# Altium schematic sheet USB.SchDoc: =project_title
size Tabloid; PageSetup: Record=PageOptions|CenterHorizontal=True|CenterVertical=True|PrintScale=0.73|XCorrection=1.00|YCorrection=1.00|PrintKind=0|BorderSize=5000000|LeftOffset=0|BottomOffset=0|Orientation=2|PaperLength=1000|PaperWidth=1000|Scale=100|PaperSource=7|PrintQuality=-4|MediaType=1|DitherType=10|PaperKind=A4|PrintScaleMode=1; CompanyName: Luxonis Holding; Organization: Luxonis Holding; Address1: 1925 Harmony Park Drive; Address2: Westminster, CO; Address3: 80234; Address4: United States; SheetNumber: 11; SheetTotal: 12
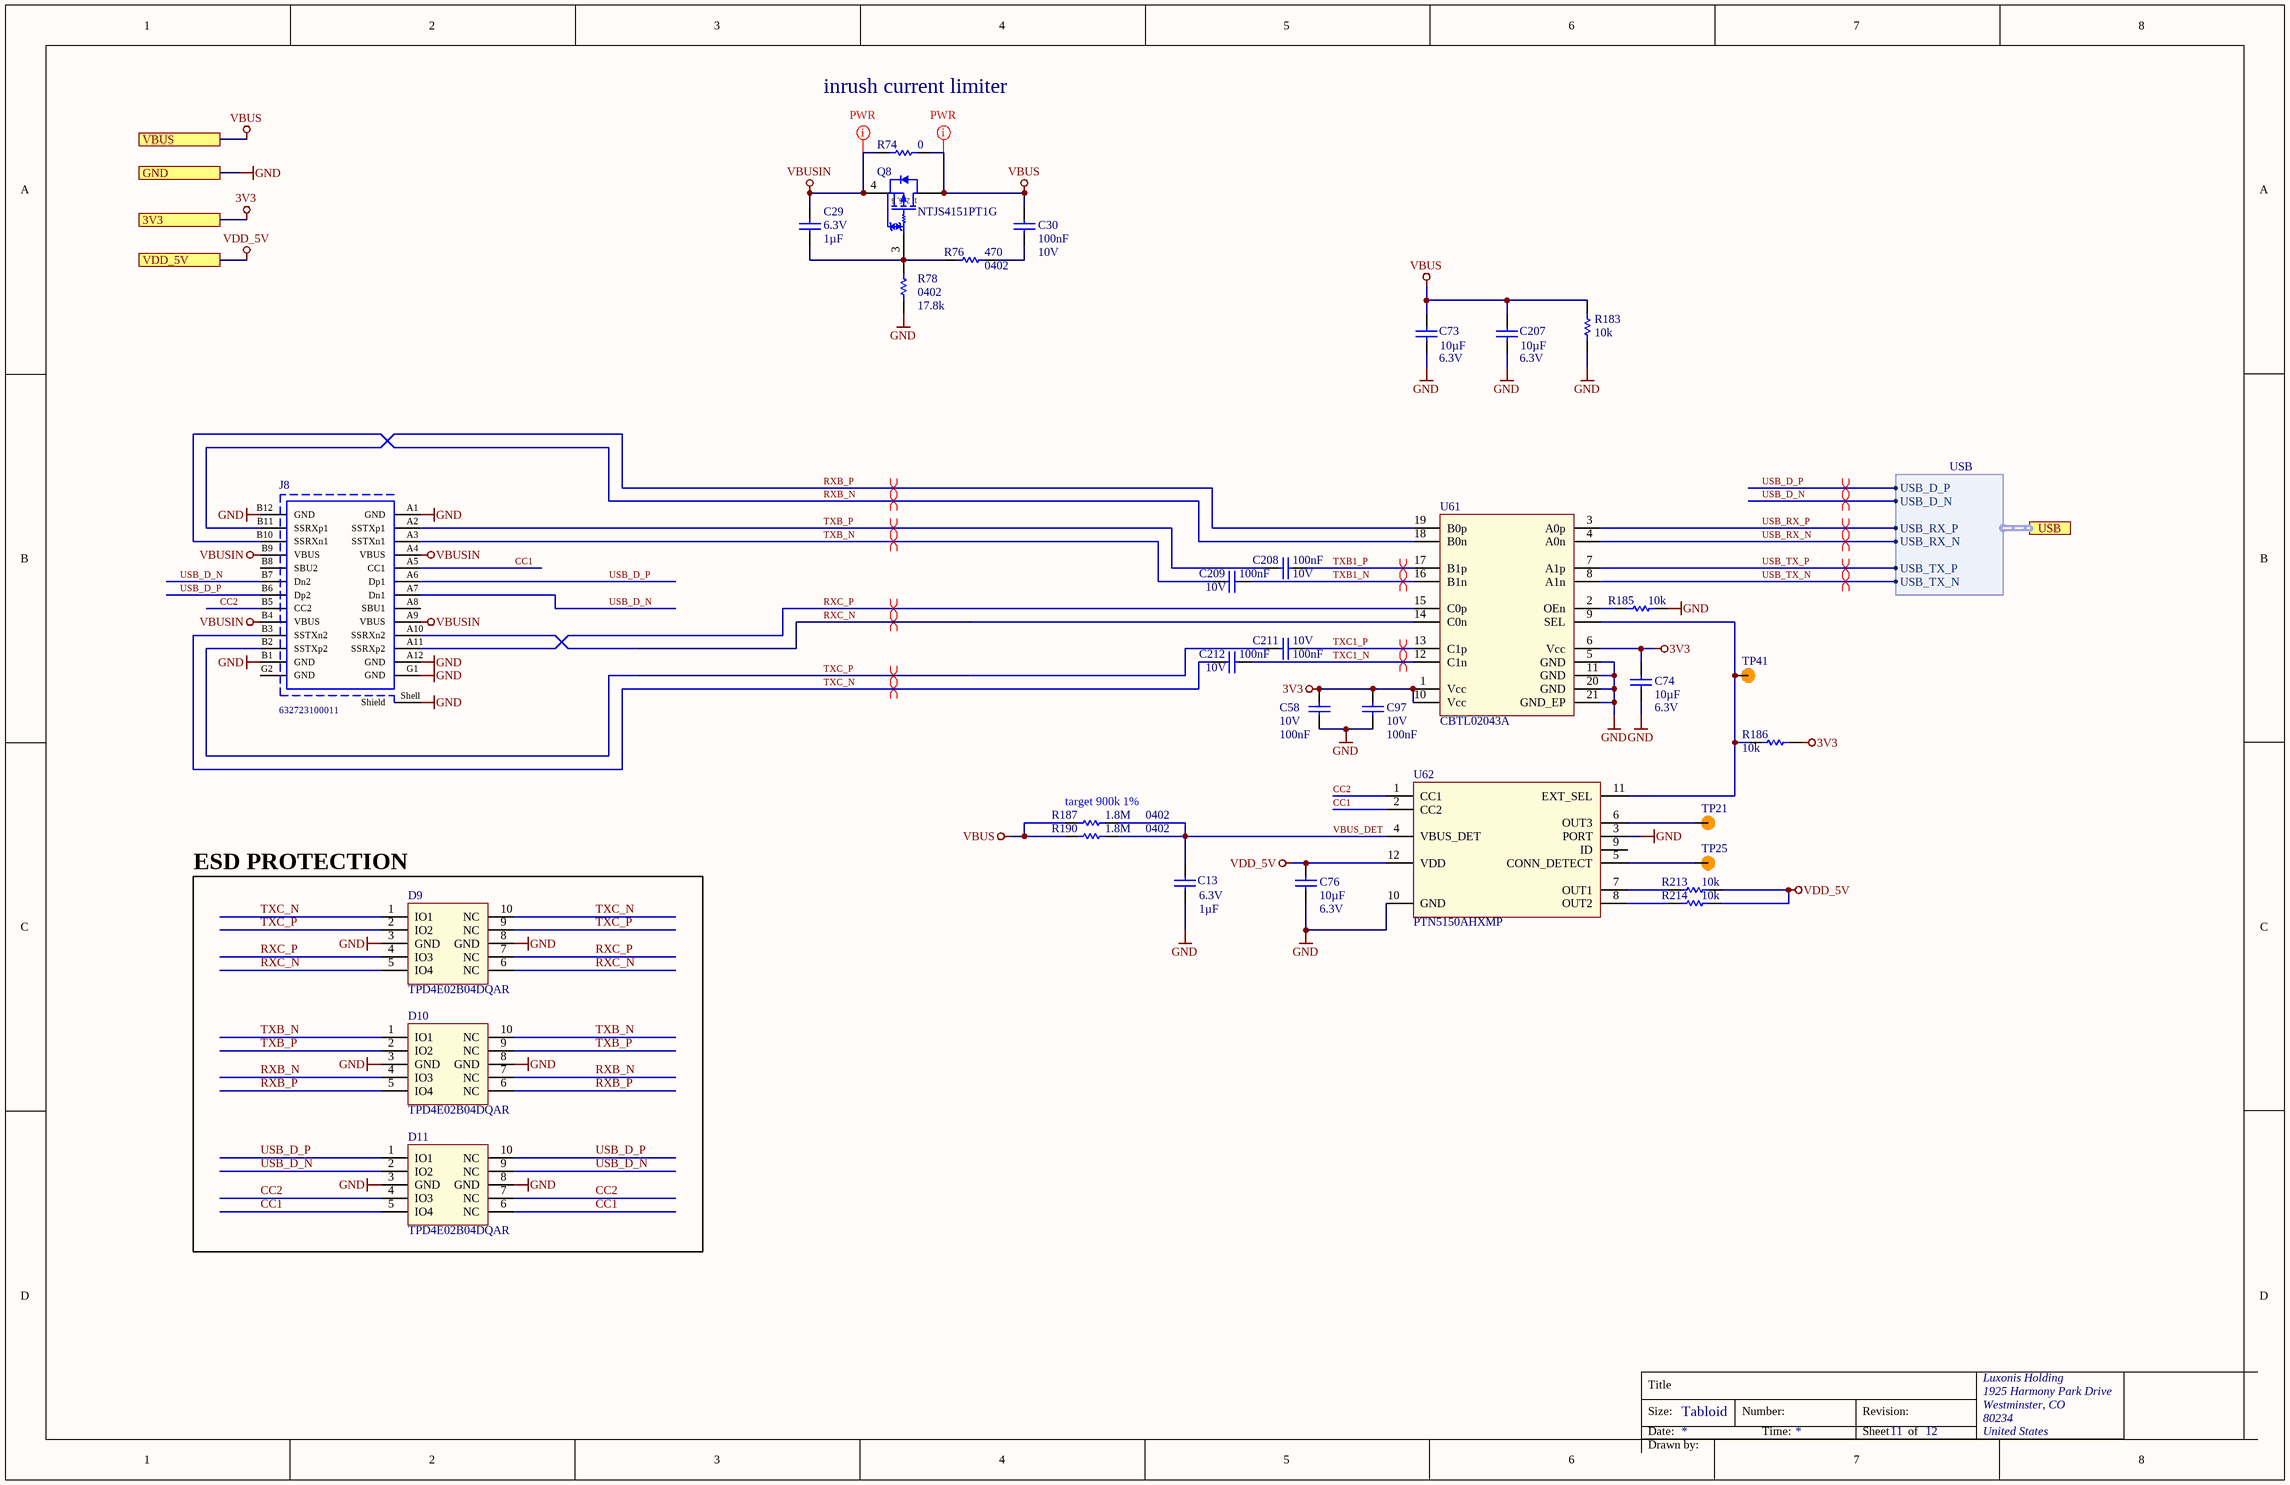
[diagram p0: USB.SchDoc]

## Parts
C13  value 1µF  Voltage Rating: 6.3V  [CAPC0201(0603)33_L]  (hidden comment: GRM033R60J105MEA2D)
C29  value 1µF  Voltage Rating: 6.3V  [CAPC0201(0603)33_L]  (hidden comment: GRM033R60J105MEA2D)
C30  value 100nF  Voltage Rating: 10V  [CAPC0201(0603)33_L]  (hidden comment: GRM033R61A104KE15D)
C58  value 100nF  Voltage Rating: 10V  [CAPC0201(0603)33_L]  (hidden comment: GRM033R61A104KE15D)
C73  value 10µF  Voltage Rating: 6.3V  [CAPC0402(1005)70_N]  (hidden comment: GRM155R60J106ME15D)
C74  value 10µF  Voltage Rating: 6.3V  [CAPC0402(1005)70_N]  (hidden comment: GRM155R60J106ME15D)
C76  value 10µF  Voltage Rating: 6.3V  [CAPC0402(1005)70_N]  (hidden comment: GRM155R60J106ME15D)
C97  value 100nF  Voltage Rating: 10V  [CAPC0201(0603)33_L]  (hidden comment: GRM033R61A104KE15D)
C207  value 10µF  Voltage Rating: 6.3V  [CAPC0402(1005)70_N]  (hidden comment: GRM155R60J106ME15D)
C208  value 100nF  Voltage Rating: 10V  [CAPC0201(0603)33_L]  (hidden comment: GRM033R61A104KE15D)
C209  value 100nF  Voltage Rating: 10V  [CAPC0201(0603)33_L]  (hidden comment: GRM033R61A104KE15D)
C211  value 100nF  Voltage Rating: 10V  [CAPC0201(0603)33_L]  (hidden comment: GRM033R61A104KE15D)
C212  value 100nF  Voltage Rating: 10V  [CAPC0201(0603)33_L]  (hidden comment: GRM033R61A104KE15D)
D9  TPD4E02B04DQAR  [TPD4E02B04DQAR]
D10  TPD4E02B04DQAR  [TPD4E02B04DQAR]
D11  TPD4E02B04DQAR  [TPD4E02B04DQAR]
J8  632723100011  [632723100011]
Q8  NTJS4151PT1G  [ONSC-SC70-6-419B-02_W_V]
R74  value 0  [RESC0603(1608)_L]  (hidden comment: CRCW06030000Z0EA)
R76  value 470  Case/Package: 0402  [RESC0402(1005)_L]  (hidden comment: CRCW0402470RFKED)
R78  value 17.8k  Case/Package: 0402  [RESC0402(1005)_L]  (hidden comment: ERJ-2RKF1782X)
R183  value 10k  [RESC0402(1005)_N]  (hidden comment: RC0402FR-1310KL)
R185  value 10k  [RESC0402(1005)_N]  (hidden comment: RC0402FR-1310KL)
R186  value 10k  [RESC0402(1005)_N]  (hidden comment: RC0402FR-1310KL)
R187  value 1.8M  Case/Package: 0402  [RESC0402(1005)_N]  (hidden comment: CRCW04021M80FKED)
R190  value 1.8M  Case/Package: 0402  [RESC0402(1005)_N]  (hidden comment: CRCW04021M80FKED)
R213  value 10k  [RESC0402(1005)_N]  (hidden comment: RC0402FR-1310KL)
R214  value 10k  [RESC0402(1005)_N]  (hidden comment: RC0402FR-1310KL)
TP21  TEST_POINT  [TP075_150_NS]  (value not drawn)  (no BOM)
TP25  TEST_POINT  [TP075_150_NS]  (value not drawn)  (no BOM)
TP41  TEST_POINT  [TP075_150_NS]  (value not drawn)  (no BOM)
U61  CBTL02043A  [CBTL02043A]
U62  PTN5150AHXMP  [PTN5150H]

## Blocks framed on the sheet
ESD PROTECTION: D9-D11

## Ports
3V3, GND, USB (harness USB), VBUS, VDD_5V

## Harnesses
USB: USB_D_P, USB_D_N, USB_TX_N, USB_TX_P, USB_RX_N, USB_RX_P

## Nets
3V3: C58.2 C74.2 C97.2 R186.2 U61.1(Vcc) U61.6(Vcc) U61.10(Vcc) ; port 3V3
GND: C13.1 C58.1 C73.1 C74.1 C76.1 C97.1 C207.1 D9.3(GND) D9.8(GND) D10.3(GND) D10.8(GND) D11.3(GND) D11.8(GND) J8.A1(GND) J8.A12(GND) J8.B1(GND) J8.B12(GND) J8.G1(GND) J8.Shell(Shield) R78.1 R183.1 R185.2 U61.5(GND) U61.11(GND) U61.20(GND) U61.21(GND_EP) U62.3(PORT) U62.10(GND) ; port GND
VBUS: C30.2 C73.2 C207.2 Q8.1(D) Q8.2(D) Q8.5(D) Q8.6(D) R74.2 R183.2 R187.1 R190.1 ; port VBUS
VBUSIN: C29.2 J8.A4(VBUS) J8.A9(VBUS) J8.B4(VBUS) J8.B9(VBUS) Q8.4(S) R74.1
VDD_5V: C76.2 R213.2 R214.2 U62.12(VDD) ; port VDD_5V
CC1: D11.5(IO4) D11.6(NC) J8.A5(CC1) U62.2(CC2)
CC2: D11.4(IO3) D11.7(NC) J8.B5(CC2) U62.1(CC1)
RXB_N: D10.4(IO3) D10.7(NC) J8.B10(SSRXn1) U61.18(B0n)
RXB_P: D10.5(IO4) D10.6(NC) J8.B11(SSRXp1) U61.19(B0p)
RXC_N: D9.5(IO4) D9.6(NC) J8.A10(SSRXn2) U61.14(C0n)
RXC_P: D9.4(IO3) D9.7(NC) J8.A11(SSRXp2) U61.15(C0p)
TXB1_N: C209.2 U61.16(B1n)
TXB1_P: C208.2 U61.17(B1p)
TXB_N: C209.1 D10.1(IO1) D10.10(NC) J8.A3(SSTXn1)
TXB_P: C208.1 D10.2(IO2) D10.9(NC) J8.A2(SSTXp1)
TXC1_N: C212.2 U61.12(C1n)
TXC1_P: C211.2 U61.13(C1p)
TXC_N: C212.1 D9.1(IO1) D9.10(NC) J8.B3(SSTXn2)
TXC_P: C211.1 D9.2(IO2) D9.9(NC) J8.B2(SSTXp2)
USB_D_N: D11.2(IO2) D11.9(NC) J8.A7(Dn1) J8.B7(Dn2) ; port USB.USB_D_N
USB_D_P: D11.1(IO1) D11.10(NC) J8.A6(Dp1) J8.B6(Dp2) ; port USB.USB_D_P
USB_RX_N: U61.4(A0n) ; port USB.USB_RX_N
USB_RX_P: U61.3(A0p) ; port USB.USB_RX_P
USB_TX_N: U61.8(A1n) ; port USB.USB_TX_N
USB_TX_P: U61.7(A1p) ; port USB.USB_TX_P
VBUS_DET: C13.2 R187.2 R190.2 U62.4(VBUS_DET)
NetC29_1: C29.1 Q8.3(G) R76.1 R78.2
NetC30_1: C30.1 R76.2
NetR185_1: R185.1 U61.2(OEn)
NetR186_1: R186.1 TP41.1 U61.9(SEL) U62.11(EXT_SEL)
NetR213_1: R213.1 U62.7(OUT1)
NetR214_1: R214.1 U62.8(OUT2)
NetTP21_1: TP21.1 U62.6(OUT3)
NetTP25_1: TP25.1 U62.5(CONN_DETECT)

Not connected (* = marked no-connect by the designer): J8 A8(SBU1) B8(SBU2) G2(GND); U62 9(ID)

## Layout directives
differential pair; differential pair class USB3: RXB_N, RXB_P, RXC_N, RXC_P, TXB1_N, TXB1_P, TXB_N, TXB_P, TXC1_N, TXC1_P, TXC_N, TXC_P, USB_D_N, USB_D_P, USB_RX_N, USB_RX_P, USB_TX_N, USB_TX_P
net class Power_trace: VBUS, VBUSIN

## Notes on the sheet
- inrush current limiter
- (near R187) target 900k 1%
- Title
- Size:
- Date:
- Tabloid
- Number:
- Time:
- Revision:
- Sheet
- of
- Drawn by:
- (in symbol CMP-061-000004-2) 1, 2, 5, 6

## Library data of the parts
C13 C29 = CMP-004-000006-5: CAP CER 1UF 6.3V X5R 0201 20%; Manufacturer 1: Murata; Manufacturer Part Number 1: GRM033R60J105MEA2D; Case/Package: 0201; Min Operating Temperature: -55°C; Max Operating Temperature: 85°C; Tolerance: 20%; Dielectric: X5R; Length: 0.6mm; Height: 0.3mm; Width: 0.3mm; Depth: 0.3mm; ComponentLink1URL: https://datasheet.ciiva.com/18699/grm033r60j105mea2-02-18699520.pdf?src-supplier=Digi-Key; ComponentLink1Description: https://datasheet.ciiva.com/18699/grm033r60j105mea2-02-18699520.pdf?src-supplier=Digi-Key; ComponentLink2URL: https://datasheet.ciiva.com/24218/c02e-24218376.pdf?src-supplier=Mouser; ComponentLink2Description: https://datasheet.ciiva.com/24218/c02e-24218376.pdf?src-supplier=Mouser; ComponentLink3URL: https://datasheet.ciiva.com/18699/partnumbering-e-01-18699519.pdf?src-supplier=Digi-Key; ComponentLink3Description: https://datasheet.ciiva.com/18699/partnumbering-e-01-18699519.pdf?src-supplier=Digi-Key; Design Item ID: GRM033R60J105MEA2D; Mounting Technology: SMT
C30 C58 C97 C208 C209 C211 C212 = CMP-004-000007-6: CAP CER 0.1UF 10V X5R 0201 10%; Manufacturer 1: Murata; Manufacturer Part Number 1: GRM033R61A104KE15D; Case/Package: 0201; Min Operating Temperature: -55°C; Max Operating Temperature: 85°C; Tolerance: 10%; Dielectric: X5R; Length: 0.6mm; Height: 0.3mm; Width: 0.012inch; Depth: 0.3mm; ComponentLink1URL: https://datasheet.ciiva.com/26843/getdatasheetpartid-308656-26843739.pdf?src-supplier=Verical; ComponentLink1Description: https://datasheet.ciiva.com/26843/getdatasheetpartid-308656-26843739.pdf?src-supplier=Verical; ComponentLink2URL: https://datasheet.ciiva.com/5413/product-5413117.pdf?src-supplier=Mouser; ComponentLink2Description: https://datasheet.ciiva.com/5413/product-5413117.pdf?src-supplier=Mouser; ComponentLink3URL: https://datasheet.ciiva.com/6256/partnumbering-e-01-6256406.pdf?src-supplier=Digi-Key; ComponentLink3Description: https://datasheet.ciiva.com/6256/partnumbering-e-01-6256406.pdf?src-supplier=Digi-Key; ComponentLink4URL: https://datasheet.ciiva.com/6256/partnumbering-e-01-6256407.pdf?src-supplier=Digi-Key; ComponentLink4Description: https://datasheet.ciiva.com/6256/partnumbering-e-01-6256407.pdf?src-supplier=Digi-Key; ComponentLink5URL: https://datasheet.ciiva.com/6256/partnumbering-e-01-6256408.pdf?src-supplier=Digi-Key; ComponentLink5Description: https://datasheet.ciiva.com/6256/partnumbering-e-01-6256408.pdf?src-supplier=Digi-Key; Design Item ID: GRM033R61A104KE15D; Mounting Technology: SMT
C73 C74 C76 C207 = CMP-004-000009-5: CAP CER 10UF 6.3V X5R 0402 20%; Manufacturer 1: Murata; Manufacturer Part Number 1: GRM155R60J106ME15D; Case/Package: 0402; Min Operating Temperature: -55°C; Max Operating Temperature: 85°C; Dielectric: X5R; Length: 0.039inch; Width: 0.02inch; ComponentLink1URL: https://www.murata.com/~/media/webrenewal/support/library/catalog/products/capacitor/mlcc/c02e.ashx?la=en-us&src-supplier=Digi-Key; ComponentLink1Description: https://www.murata.com/~/media/webrenewal/support/library/catalog/products/capacitor/mlcc/c02e.ashx?la=en-us&src-supplier=Digi-Key; Tolerance: 20%; Design Item ID: GRM155R60J106ME15D; Mounting Technology: SMT
D9-D11 = CMP-111-000006-2: TVS DIODE 3.6V 8.8V 10USON 8.8V (Typ) Clamp 5A (8/20µs) Ipp Tvs Diode Surface Mount 10-USON (2.5x1); Manufacturer 1: Texas Instruments; Number of Bidirectional Channels: 4; Min Breakdown Voltage: 5.5V; Peak Pulse Power: 17W; Power Line Protection: No; Interface: USB,HDMI; Manufacturer Part Number 1: TPD4E02B04DQAR; Stock 1: 25615; Pricing 1: 1=0.69000, 10=0.60800, 100=0.46650, 500=0.36874, 1000=0.29499 (USD); RoHS: Yes; Mount: Surface Mount; Number of Pins: 10; Min Operating Temperature: -40°C; Max Operating Temperature: 125°C; Packaging: Cut Tape; Reverse Standoff Voltage: 3.6V; Clamping Voltage: 8.8V; Operating Supply Voltage: 3.6V; Peak Pulse Current: 5A; Number of Channels: 4; Composition: Zener; REACH SVHC: No SVHC; Lead Free: Lead Free; ComponentLink1URL: http://www.ti.com/general/docs/lit/getliterature.tsp?genericPartNumber=TPD4E02B04&amp;&amp;fileType=pdf&src-supplier=Element14; ComponentLink1Description: http://www.ti.com/general/docs/lit/getliterature.tsp?genericPartNumber=TPD4E02B04&amp;&amp;fileType=pdf&src-supplier=Element14; ComponentLink2URL: http://www.ti.com/lit/ds/symlink/tpd4e02b04.pdf?src-supplier=Farnell; ComponentLink2Description: http://www.ti.com/lit/ds/symlink/tpd4e02b04.pdf?src-supplier=Farnell; ComponentLink3URL: http://www.ti.com/lit/ds/symlink/tpd4e02b04.pdf?src-supplier=Newark; ComponentLink3Description: http://www.ti.com/lit/ds/symlink/tpd4e02b04.pdf?src-supplier=Newark; ComponentLink4URL: http://www.ti.com/lit/ds/symlink/tpd4e02b04.pdf?src-supplier=Digi-Key; ComponentLink4Description: http://www.ti.com/lit/ds/symlink/tpd4e02b04.pdf?src-supplier=Digi-Key; Design Item ID: TPD4E02B04DQAR; Source: BW2098POE_1.SCHLIB
J8 = CMP-002-00096-2: USB C 3.1 Connector, 24 Contact(s), Female, Right Angle, Solder and Surface Mount Terminal, Receptacle; Manufacturer 1: Wurth Electronics; Connector Type: TELECOM AND DATACOM CONNECTOR; RoHS Compliant: Yes; Supplier Part Number 1: 732-9617-2-ND; Manufacturer Part Number 1: 632723100011; Gender: Female; Pins: 24; Supplier 1: Digikey
Q8 = CMP-061-000004-2: Trench Power MOSFET, -20 V, -4.2 A, Single P-Channel, 6-Pin SC70, Pb-Free, Tape and Reel; Manufacturer 1: ON Semiconductor; PD Max (W): 1; Continuous Drain Current: 4.2A; Transistor Type: P Channel; Mounting Technology: Surface Mount; PartNumber: NTJS4151PT1G; Manufacturer Part Number 1: NTJS4151PT1G; Design Item ID: NTJS4151PT1G
R74 = CMP-115-000011-7: RES SMD 0 OHM 5% 1/10W 0603; Manufacturer 1: Vishay; Manufacturer Part Number 1: CRCW0603-0000Z0EA; Power Rating: 100mW; Voltage Rating: 75V; Temperature Coefficient: 100ppm/°C; Case/Package: 0603; Min Operating Temperature: -55°C; Max Operating Temperature: 155°C; Tolerance: 5%; Design Item ID: CRCW06030000Z0EA
R76 = CMP-013-000029-9: RES SMD 470 OHM 1% 1/16W 0402; Manufacturer 1: Vishay; Power Rating: 63mW; Voltage Rating: 50V; Manufacturer Part Number 1: CRCW0402470RFKED; Min Operating Temperature: -55°C; Max Operating Temperature: 155°C; Tolerance: 1%; Design Item ID: CRCW0402470RFKED
R78 = CMP-013-000001-9: RES SMD 17.8K OHM 1% 1/10W 0402; Manufacturer 1: Panasonic; Power Rating: 100mW; Voltage Rating: 50V; Min Operating Temperature: -55°C; Max Operating Temperature: 155°C; Manufacturer Part Number 1: ERJ-2RKF1782X; Tolerance: 1%; Design Item ID: ERJ-2RKF1782X
R183 R185 R186 = CMP-115-000004-8: RES SMD 10K OHM 1% 1/16W 0402; Manufacturer 1: Yageo; Temperature Coefficient: 100ppm/°C; Power Rating: 62.5mW; Voltage Rating: 50V; Manufacturer Part Number 1: RC0402FR-1310KL; Case/Package: 0402; Min Operating Temperature: -55°C; Max Operating Temperature: 155°C; Tolerance: 1%; Design Item ID: RC0402FR-1310KL
R187 R190 = CMP-013-000023-8: RES SMD 1.8M OHM 1% 1/16W 0402; Manufacturer 1: Vishay; Voltage Rating: 50V; Power Rating: 63mW; Manufacturer Part Number 1: CRCW04021M80FKED; Min Operating Temperature: -55°C; Max Operating Temperature: 155°C; Tolerance: 1%; Design Item ID: CRCW04021M80FKED
R213 R214 = CMP-115-000004-8: RES SMD 10K OHM 1% 1/16W 0402; Manufacturer 1: Yageo; Voltage Rating: 50V; Power Rating: 62.5mW; Temperature Coefficient: 100ppm/°C; Tolerance: 1%; Max Operating Temperature: 155°C; Case/Package: 0402; Design Item ID: RC0402FR-1310KL; Min Operating Temperature: -55°C; Manufacturer Part Number 1: RC0402FR-1310KL
TP21 TP25 TP41 = CMP-015-000000-2: Manufacturer Part Number 1: /; Design Item ID: TEST_POINT; Source: LuxonisMaster.SchLib
U61 = CMP-045-000000-2: Multiplexer And Demux/Decoder, CBT/FST/QS/5C/B Series, 1-Func, 2 Line Input, 1 Line Output, True Output, PQCC20; Manufacturer Part Number 1: CBTL02043ABQ,115; Manufacturer 1: NXP Semiconductors
U62 = CMP-044-000000-3: Power Supply Support Circuit, Fixed, 2 Channel, 0.2, PQCC12; Manufacturer Part Number 1: PTN5150HXMP; Manufacturer 1: NXP Semiconductors